# EasyEDA Pro project 2025_11_15_drone.epro

# Schematic Schematic1
Board Name: Board1; Create Date: 2025-11-15; Page Name: P1; Project Name: 2025_11_15_drone; Schematic Name: Schematic1; Update Date: 2025-11-15; Company: EasyEDA.com; Page Size: A4; Version: V1.0
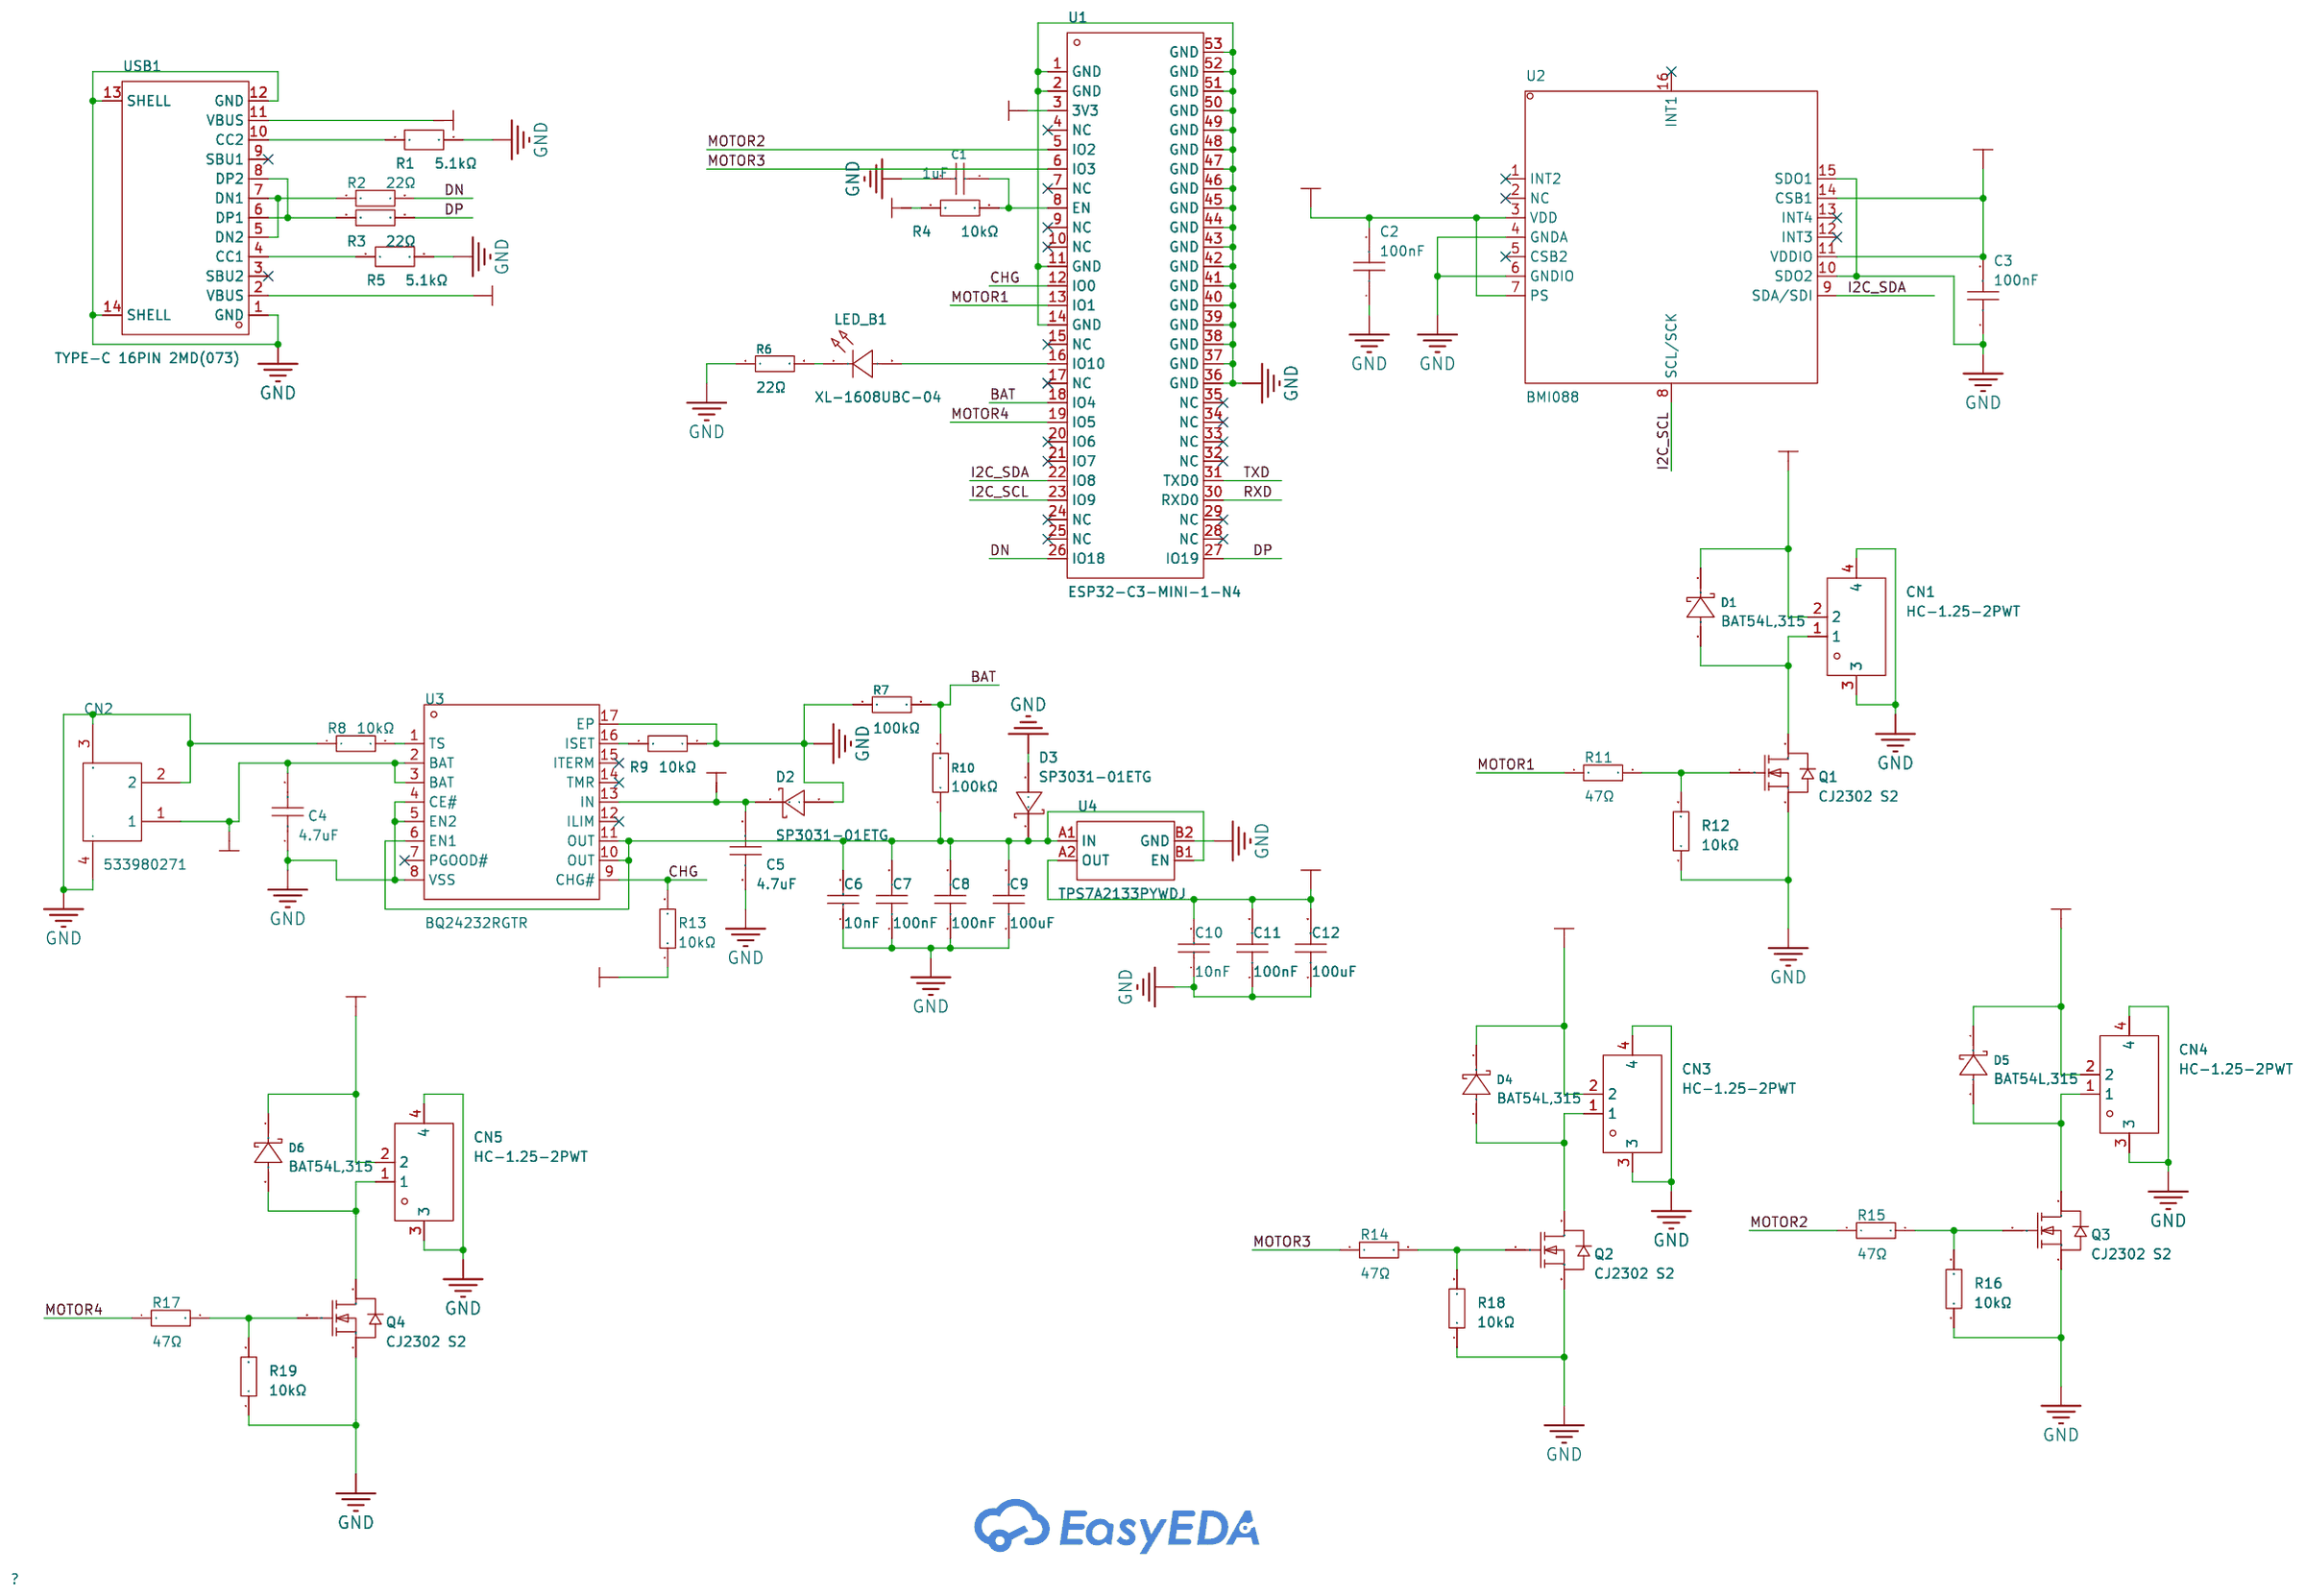
[diagram p0: schematic sheet]

## Parts
C1  1uF  [C0402]
C2  100nF  [C0402]
C3  100nF  [C0402]
C4  4.7uF  [C0402]
C5  4.7uF  [C0402]
C6  10nF  [C0402]
C7  100nF  [C0603]
C8  100nF  [C0603]
C9  100uF  [C1206]
C10  10nF  [C0402]
C11  100nF  [C0603]
C12  100uF  [C1206]
CN1  HC-1.25-2PWT  [CONN-SMD_2P-P1.25-HC-1.25-2PWT]
CN2  533980271  [CONN-SMD_2P-P1.25_053398-0X71]
CN3  HC-1.25-2PWT  [CONN-SMD_2P-P1.25-HC-1.25-2PWT]
CN4  HC-1.25-2PWT  [CONN-SMD_2P-P1.25-HC-1.25-2PWT]
CN5  HC-1.25-2PWT  [CONN-SMD_2P-P1.25-HC-1.25-2PWT]
D1  BAT54L,315  [DFN1006-2L-RD]
D2  SP3031-01ETG  [SOD-882_L1.0-W0.6-RD]
D3  SP3031-01ETG  [SOD-882_L1.0-W0.6-RD]
D4  BAT54L,315  [DFN1006-2L-RD]
D5  BAT54L,315  [DFN1006-2L-RD]
D6  BAT54L,315  [DFN1006-2L-RD]
LED_B1  XL-1608UBC-04  [LED0603-RD_BLUE]
Q1  CJ2302 S2  [SOT-23-3_L3.0-W1.7-P0.95-LS2.9-BR]
Q2  CJ2302 S2  [SOT-23-3_L3.0-W1.7-P0.95-LS2.9-BR]
Q3  CJ2302 S2  [SOT-23-3_L3.0-W1.7-P0.95-LS2.9-BR]
Q4  CJ2302 S2  [SOT-23-3_L3.0-W1.7-P0.95-LS2.9-BR]
R1  5.1kΩ  [R0603]
R2  22Ω  [R0603]
R3  22Ω  [R0603]
R4  10kΩ  [R0603]
R5  5.1kΩ  [R0603]
R6  22Ω  [R0402]
R7  100kΩ  [R0603]
R8  10kΩ  [R0603]
R9  10kΩ  [R0603]
R10  100kΩ  [R0603]
R11  47Ω  [R0402]
R12  10kΩ  [R0402]
R13  10kΩ  [R0603]
R14  47Ω  [R0402]
R15  47Ω  [R0402]
R16  10kΩ  [R0402]
R17  47Ω  [R0402]
R18  10kΩ  [R0402]
R19  10kΩ  [R0402]
U1  ESP32-C3-MINI-1-N4  [WIFIM-SMD_ESP32-C3-MINI-1]
U2  BMI088  [LGA-16_L4.5-W3.0-P0.50-BL]
U3  BQ24232RGTR  [VQFN-16_L3.0-W3.0-P0.50-TL-EP]
U4  TPS7A2133PYWDJ  [DSBGA-4_L0.6-W0.6-P0.35-TL]
USB1  TYPE-C 16PIN 2MD(073)  [USB-C-SMD_TYPE-C-6PIN-2MD-073]

## Library data of the parts
C1 = CL05A105KO5NNNC: Capacitance:1uF Tolerance:±10% Tolerance:±10% Voltage Rating:16V Temperature Coefficient:X5R; LCSC Part Name: 1uF ±10% 16V; Supplier Part: C29266; Manufacturer: SAMSUNG(三星); Supplier Footprint: 0402; JLCPCB Part Class: Extended Part; Datasheet: https://item.szlcsc.com/datasheet/CL05A105KO5NNNC/30018.html; Supplier: LCSC; Tolerance: ±10%; Voltage Rating: 16V; Temperature Coefficient: X5R
C2 C3 = CL05B104KO5NNNC: Capacitance: Tolerance:±10% Tolerance:±10% Voltage Rated: Temperature Coefficient:; LCSC Part Name: 100nF ±10% 16V; Supplier Part: C1525; Manufacturer: SAMSUNG(三星); Supplier Footprint: 0402; JLCPCB Part Class: Basic Part; Datasheet: https://atta.szlcsc.com/upload/public/pdf/source/20160218/1457707763339.pdf; Supplier: LCSC; Tolerance: ±10%
C4 C5 = CL05A475MQ5NRNC_C307423: Capacitance:4.7uF Tolerance:±20% Tolerance:±20% Voltage Rating:6.3V Temperature Coefficient:X5R; LCSC Part Name: 4.7uF ±20% 6.3V; Supplier Part: C307423; Manufacturer: SAMSUNG(三星); Manufacturer Part: CL05A475MQ5NRNC; Supplier Footprint: 0402; JLCPCB Part Class: Extended Part; Datasheet: https://item.szlcsc.com/datasheet/CL05A475MQ5NRNC/291097.html; Supplier: LCSC; Tolerance: ±20%; Voltage Rating: 6.3V; Temperature Coefficient: X5R
C6 C10 = CL05B103KB5NNNC: Capacitance:10nF Tolerance:±10% Tolerance:±10% Voltage Rating:50V Temperature Coefficient:X7R; LCSC Part Name: 10nF ±10% 50V; Supplier Part: C15195; Manufacturer: SAMSUNG(三星); Supplier Footprint: 0402; JLCPCB Part Class: Basic Part; Datasheet: https://item.szlcsc.com/datasheet/CL05B103KB5NNNC/15869.html; Supplier: LCSC; Tolerance: ±10%; Voltage Rating: 50V; Temperature Coefficient: X7R
C7 C8 C11 = CC0603KRX7R9BB104: Capacitance:100nF Tolerance:±10% Tolerance:±10% Voltage Rating:50V Temperature Coefficient:X7R; LCSC Part Name: 100nF ±10% 50V; Supplier Part: C14663; Manufacturer: YAGEO(国巨); Supplier Footprint: 0603; Datasheet: https://item.szlcsc.com/datasheet/CC0603KRX7R9BB104/15331.html; Supplier: LCSC; Tolerance: ±10%; Voltage Rating: 50V; Temperature Coefficient: X7R
C9 C12 = HGC1206R5107M100NSPJ: Capacitance:100uF Tolerance:±20% Tolerance:±20% Voltage Rating:10V Temperature Coefficient:X5R; LCSC Part Name: 100uF ±20% 10V; Supplier Part: C7432784; Manufacturer: Chinocera(华瓷); Supplier Footprint: 1206; JLCPCB Part Class: Extended Part; Datasheet: https://atta.szlcsc.com/upload/public/pdf/source/20240320/FAC3FEC40A78BC5CCCE96C232A94D860.pdf; Supplier: LCSC; Tolerance: ±20%; Voltage Rating: 10V; Temperature Coefficient: X5R
CN1 CN3-CN5 = HC-1.25-2PWT: Pins Structure:1x2P Pitch:1.25mm Mounting Style:Horizontal attachment Reference Series:PicoBlade(MX 1.25) Number of Pins:2P Number of Rows:1 Number of PINs Per Row:2 Row Spacing:- Current Rating (Max):1A Contact Material:Brass Contact Plating:Tin Operatin; LCSC Part Name: 1x2P 间距:1.25mm 卧贴 系列:PicoBlade(MX 1.25); Supplier Part: C2845379; Manufacturer: HCTL(华灿天禄); Supplier Footprint: SMD,P=1.25mm,卧贴; JLCPCB Part Class: Extended Part; Datasheet: https://atta.szlcsc.com/upload/public/pdf/source/20240930/9508A8292CCC87B0C29E3A028D56E30A.pdf; Supplier: LCSC; Pins Structure: 1x2P; Pitch: 1.25mm; Mounting Style: Horizontal attachment; Reference Series: PicoBlade(MX 1.25); Number of Pins: 2P; Number of Rows: 1; Number of PINs Per Row: 2; Current Rating (Max): 1A; Contact Material: Brass; Contact Plating: Tin; Operating Temperature Range: -40℃~+105℃; Rated Voltage (Max): 125V; Plastic Material: LCP; Flame Retardant Rating: UL94V-0; Supplementary Features: Auxiliary soldering legs; Z-Height of the Board: 3.57mm; X-Length of Bottom Edge on Board (Spacing Line): 7.55mm; Y-Width of Bottom Edge on Board: 5.25mm
CN2 = 533980271_C122410: Pins Structure:1x2P Pitch:1.25mm Mounting Type:Surface Mount,Vertical Reference Series:PicoBlade(MX 1.25) Number of Pins:2P Number of Rows:1 Number of PINs Per Row:2 Row Spacing:- Current Rating:1A Contact Material:Phosphor Bronze Contact Plating:Tin Oper; LCSC Part Name: 1x2P 间距:1.25mm 立贴 系列:PicoBlade(MX 1.25); Supplier Part: C122410; Manufacturer: MOLEX; Supplier Footprint: SMD,P=1.25mm; JLCPCB Part Class: Extended Part; Datasheet: https://www.molex.com/content/dam/molex/molex-dot-com/products/automated/en-us/salesdrawingpdf/533/53398/533980271_sd.pdf?inline; Supplier: LCSC; Pins Structure: 1x2P; Pitch: 1.25mm; Mounting Type: Surface Mount,Vertical; Reference Series: PicoBlade(MX 1.25); Number of Pins: 2P; Number of Rows: 1; Number of PINs Per Row: 2; Current Rating: 1A; Contact Material: Phosphor Bronze; Contact Plating: Tin; Operating Temperature: -40℃~+105℃; Voltage Rating: 125V; Plastic Material: Glass-Fiber Reinforced PA; Flame Retardant Rating: UL94V-0; Supplementary Features: Auxiliary Solder Pin; Color: White; Z-Height of the Board: 4.7mm; X-Length of Bottom Edge on Board (Spacing Line): 7.65mm; Y-Width of Bottom Edge on Board: 4.2mm
D1 D4-D6 = BAT54L,315: Voltage - Forward(Vf@If):800mV@100mA Voltage - DC Reverse(Vr):30V Current - Rectified:200mA Reverse Leakage Current (Ir):2uA@25V Non-Repetitive Peak Forward Surge Current:600mA; LCSC Part Name: 电压:30V 电流:200mA; Supplier Part: C549279; Manufacturer: Nexperia(安世); Supplier Footprint: DFN1006-2; JLCPCB Part Class: Extended Part; Datasheet: https://item.szlcsc.com/datasheet/BAT54L%252C315/570347.html; Supplier: LCSC; Voltage - Forward(Vf@If): 800mV@100mA; Voltage - DC Reverse(Vr): 30V; Current - Rectified: 200mA; Reverse Leakage Current (Ir): 2uA@25V; Non-Repetitive Peak Forward Surge Current: 600mA
D2 D3 = SP3031-01ETG: Polarity:Unidirectional Reverse Stand-Off Voltage (Vrwm):5V Clamping Voltage:7.5V Peak Pulse Current (Ipp):5A@8/20us Peak Pulse Power Dissipation (Ppp):- Voltage - Breakdown:6V Reverse Leakage Current (Ir):1uA Number of Channels:1.0 level of protection:IE; Supplier Part: C207283; Manufacturer: Littelfuse(美国力特); Supplier Footprint: SOD-882; JLCPCB Part Class: Extended Part; Datasheet: https://item.szlcsc.com/datasheet/SP3031-01ETG/208402.html; Supplier: LCSC; Polarity: Unidirectional; Reverse Stand-Off Voltage (Vrwm): 5V; Clamping Voltage: 7.5V; Peak Pulse Current (Ipp): 5A@8/20us; Voltage - Breakdown: 6V; Reverse Leakage Current (Ir): 1uA; Number of Channels: 1.0; level of protection: IEC 61000-4-4；IEC 61000-4-5；IEC 61000-4-2; Type: TVS; Junction Capacitance: 0.8pF
LED_B1 = XL-1608UBC-04: Lamp Holder Type:- Illumination Color:Blue Voltage - Forward(Vf):3.3V Voltage - Forward(Vf):3.3V Power(Watts):70mW Forward Current:20mA Wavelength - Dominant:455nm~475nm Wavelength - Dominant:455nm~475nm Peak Wavelength:470nm Diode Configuration:- Lens Co; Supplier Part: C965807; Manufacturer: XINGLIGHT(成兴光); Supplier Footprint: 0603; JLCPCB Part Class: Extended Part; Datasheet: https://item.szlcsc.com/datasheet/XL-1608UBC-04/1051416.html; Supplier: LCSC; Illumination Color: Blue; Voltage - Forward(Vf): 3.3V; Power(Watts): 70mW; Forward Current: 20mA; Wavelength - Dominant: 455nm~475nm; Peak Wavelength: 470nm; Lens Color: Water Clear; Luminous Intensity: 300mcd; Viewing Angle: 120°; Mounting Style: op View Mount
Q1-Q4 = CJ2302 S2: Type:1 N-Channel Drain Source Voltage (Vdss): Continuous Drain Current (Id): Drain Source On Resistance (RDS(on)@Vgs,Id):0.115Ω@2.5V,3.1A Power Dissipation (Pd):350mW Gate Threshold Voltage (Vgs(th)@Id):1.2V@50uA Total Gate Charge (Qg@Vgs):10nC@4.5V Input; LCSC Part Name: 1个N沟道 耐压:20V 电流:2.1A; Supplier Part: C8548; Manufacturer: CJ(江苏长电/长晶); Supplier Footprint: SOT-23; JLCPCB Part Class: Extended Part; Datasheet: https://atta.szlcsc.com/upload/public/pdf/source/20130613/1457706609595.pdf; Supplier: LCSC; Type: 1 N-Channel; Drain Source On Resistance (RDS(on)@Vgs,Id): 0.115Ω@2.5V,3.1A; Power Dissipation (Pd): 350mW; Gate Threshold Voltage (Vgs(th)@Id): 1.2V@50uA; Total Gate Charge (Qg@Vgs): 10nC@4.5V; Input Capacitance (Ciss@Vds): 300pF@10V; Reverse Transfer Capacitance (Crss@Vds): 80pF@10V; Operating Temperature: -55℃~+150℃
R1 R5 = FRC0603F5101TS: Type:Thick Film Resistor Resistance:5.1kΩ Tolerance:±1% Tolerance:±1% Power(Watts):100mW Voltage-Supply(Max):75V Temperature Coefficient:±100ppm/℃ Temperature Coefficient:±100ppm/℃ Operating Temperature:-55℃~+155℃ Operating Temperature:-55℃~+155℃; LCSC Part Name: 5.1kΩ ±1% 100mW 厚膜电阻; Supplier Part: C2907044; Manufacturer: FOJAN(富捷); Supplier Footprint: 0603; JLCPCB Part Class: Extended Part; Supplier: LCSC; Type: Thick Film Resistor; Tolerance: ±1%; Power(Watts): 100mW; Voltage-Supply(Max): 75V; Temperature Coefficient: ±100ppm/℃; Operating Temperature: -55℃~+155℃
R2 R3 = 0603WAF220JT5E: Type:Thick Film Resistors Resistance:22Ω Tolerance:±1% Tolerance:±1% Power(Watts): Overload Voltage (Max): Temperature Coefficient:±100ppm/℃ Temperature Coefficient:±100ppm/℃ Operating Temperature Range:-55℃~+155℃ Operating Temperature Range:-55℃~+155℃; LCSC Part Name: 22Ω ±1% 100mW 厚膜电阻; Supplier Part: C23345; Manufacturer: UNI-ROYAL(厚声); Supplier Footprint: 0603; JLCPCB Part Class: Basic Part; Datasheet: https://atta.szlcsc.com/upload/public/pdf/source/20200306/C422600_1E6D84923E4A46A82E41ADD87F860B5C.pdf; Supplier: LCSC; Type: Thick Film Resistors; Tolerance: ±1%; Temperature Coefficient: ±100ppm/℃; Operating Temperature Range: -55℃~+155℃
R4 R8 R9 R13 = RC0603FR-0710KL: Type:Thick Film Resistors Resistance: Tolerance:±1% Tolerance:±1% Power(Watts): Overload Voltage (Max): Temperature Coefficient:±100ppm/℃ Temperature Coefficient:±100ppm/℃ Operating Temperature Range:-55℃~+155℃ Operating Temperature Range:-55℃~+155℃; LCSC Part Name: 厚膜电阻 10kΩ ±1% 100mW; Supplier Part: C98220; Manufacturer: YAGEO(国巨); Supplier Footprint: 0603; JLCPCB Part Class: Extended Part; Datasheet: https://atta.szlcsc.com/upload/public/pdf/source/20180927/C295883_E8D83085EA81BD7DE0B2B681138C15EE.pdf; Supplier: LCSC; Type: Thick Film Resistors; Tolerance: ±1%; Temperature Coefficient: ±100ppm/℃; Operating Temperature Range: -55℃~+155℃
R6 = 0402WGF220JTCE: Type:Thick Film Resistors Resistance:22Ω Tolerance:±1% Tolerance:±1% Power(Watts): Overload Voltage (Max): Temperature Coefficient:±100ppm/℃ Temperature Coefficient:±100ppm/℃ Operating Temperature Range:-55℃~+155℃ Operating Temperature Range:-55℃~+155℃; LCSC Part Name: 22Ω ±1% 62.5mW 厚膜电阻; Supplier Part: C25092; Manufacturer: UNI-ROYAL(厚声); Supplier Footprint: 0402; JLCPCB Part Class: Basic Part; Datasheet: https://atta.szlcsc.com/upload/public/pdf/source/20200306/C422600_1E6D84923E4A46A82E41ADD87F860B5C.pdf; Supplier: LCSC; Type: Thick Film Resistors; Tolerance: ±1%; Temperature Coefficient: ±100ppm/℃; Operating Temperature Range: -55℃~+155℃
R7 R10 = RC0603FR-07100KL: Type:Thick Film Resistors Resistance: Tolerance:±1% Tolerance:±1% Power(Watts): Overload Voltage (Max): Temperature Coefficient:±100ppm/℃ Temperature Coefficient:±100ppm/℃ Operating Temperature Range:-55℃~+155℃ Operating Temperature Range:-55℃~+155℃; LCSC Part Name: 厚膜电阻 100kΩ ±1% 100mW; Supplier Part: C14675; Manufacturer: YAGEO(国巨); Supplier Footprint: 0603; JLCPCB Part Class: Extended Part; Datasheet: https://atta.szlcsc.com/upload/public/pdf/source/20140324/1457707028752.pdf; Supplier: LCSC; Type: Thick Film Resistors; Tolerance: ±1%; Temperature Coefficient: ±100ppm/℃; Operating Temperature Range: -55℃~+155℃
R11 R14 R15 R17 = RC0402FR-0747RL: Type:Thick Film Resistor Resistance:47Ω Tolerance:±1% Tolerance:±1% Power(Watts):62.5mW Voltage-Supply(Max):50V Temperature Coefficient:±100ppm/℃ Temperature Coefficient:±100ppm/℃ Operating Temperature:-55℃~+155℃ Operating Temperature:-55℃~+155℃; LCSC Part Name: 厚膜电阻 47Ω ±1% 62.5mW; Supplier Part: C137973; Manufacturer: YAGEO(国巨); Supplier Footprint: 0402; Datasheet: https://item.szlcsc.com/datasheet/RC0402FR-0747RL/149289.html; Supplier: LCSC; Type: Thick Film Resistor; Tolerance: ±1%; Power(Watts): 62.5mW; Voltage-Supply(Max): 50V; Temperature Coefficient: ±100ppm/℃; Operating Temperature: -55℃~+155℃
R12 R16 R18 R19 = RC0402FR-0710KL: Type:Thick Film Resistor Resistance:10kΩ Tolerance:±1% Tolerance:±1% Power(Watts):62.5mW Voltage-Supply(Max):50V Temperature Coefficient:±100ppm/℃ Temperature Coefficient:±100ppm/℃ Operating Temperature:-55℃~+155℃ Operating Temperature:-55℃~+155℃; LCSC Part Name: 厚膜电阻 10kΩ ±1% 62.5mW; Supplier Part: C60490; Manufacturer: YAGEO(国巨); Supplier Footprint: 0402; Datasheet: https://item.szlcsc.com/datasheet/RC0402FR-0710KL/61542.html; Supplier: LCSC; Type: Thick Film Resistor; Tolerance: ±1%; Power(Watts): 62.5mW; Voltage-Supply(Max): 50V; Temperature Coefficient: ±100ppm/℃; Operating Temperature: -55℃~+155℃
U1 = ESP32-C3-MINI-1-N4: Supplier Part: C2838502; Manufacturer: ESPRESSIF(乐鑫); Supplier Footprint: SMD,13.2x16.6mm; JLCPCB Part Class: Extended Part; Datasheet: https://item.szlcsc.com/datasheet/ESP32-C3-MINI-1-N4/3013227.html; Supplier: LCSC
U2 = BMI088: Sensor Type:加速度计陀螺仪 Operating Temperature:-40℃~+85℃ Operating Temperature:-40℃~+85℃; Supplier Part: C194919; Manufacturer: Bosch(博世); Supplier Footprint: LGA-16(3x4.5); JLCPCB Part Class: Extended Part; Datasheet: https://atta.szlcsc.com/upload/public/pdf/source/20180628/C194919_66CCF125FF968C218A4D358C68AC68D6.pdf; Supplier: LCSC; Sensor Type: 加速度计陀螺仪; Operating Temperature: -40℃~+85℃
U3 = BQ24232RGTR: LCSC Part Name: USB友好型锂离子电池充电器及电源路径管理IC; Supplier Part: C528622; Manufacturer: TI(德州仪器); Supplier Footprint: VQFN-16-EP(3x3); JLCPCB Part Class: Extended Part; Datasheet: https://www.ti.com/cn/lit/gpn/bq24232; Supplier: LCSC
U4 = TPS7A2133PYWDJ: Output Type:Fixed Maximum Input Voltage:6V Output Voltage:3.3V Output Voltage:3.3V Output Current:500mA Power Supply Rejection Ratio (PSRR):61dB@(100Hz) Operating Temperature:-40℃~+125℃@(Tj) Operating Temperature:-40℃~+125℃@(Tj) Output Polarity:Positive e; LCSC Part Name: 500mA 低噪声、低 IQ、高 PSRR 低压降 (LDO) 稳压器; Supplier Part: C3019997; Manufacturer: TI(德州仪器); Supplier Footprint: DSBGA-4; JLCPCB Part Class: Extended Part; Datasheet: https://www.ti.com/cn/lit/gpn/tps7a21; Supplier: LCSC; Output Type: Fixed; Maximum Input Voltage: 6V; Output Voltage: 3.3V; Output Current: 500mA; Power Supply Rejection Ratio (PSRR): 61dB@(100Hz); Operating Temperature: -40℃~+125℃@(Tj); Output Polarity: Positive electrode; Number of Outputs: 1
USB1 = TYPE-C 16PIN 2MD(073): Connector Type:Type-C Protocol Standard:- Gender:Female Mounting Type:Surface Mount, Right Angle Number of Contacts:16P Number of Ports:1 Current Rating-Power:3A Voltage Rating:5V Connect-Disconnect Life:5,000 Cycles Supplementary Features:- Center Height; LCSC Part Name: Type-C 母 卧贴; Supplier Part: C2765186; Manufacturer: SHOU HAN(首韩); Supplier Footprint: SMD; JLCPCB Part Class: Extended Part; Datasheet: https://item.szlcsc.com/datasheet/TYPE-C%252016PIN%25202MD(073)/2901843.html; Supplier: LCSC; Connector Type: Type-C; Gender: Female; Mounting Type: Surface Mount, Right Angle; Number of Contacts: 16P; Number of Ports: 1; Current Rating-Power: 3A; Voltage Rating: 5V; Connect-Disconnect Life: 5,000 Cycles; Detection color: Black; Operating Temperature: -25℃~+85℃

## Nets
3V3: C2.2 C3.2 C10.2 C11.2 C12.2 CN1.2 CN3.2 CN4.2 CN5.2 D1.1(K) D4.1(K) D5.1(K) D6.1(K) R4.2 R13.1 U1.3(3V3) U2.3(VDD) U2.7(PS) U2.11(VDDIO) U2.14(CSB1) U4.A2(OUT)
GND: C1.2 C2.1 C3.1 C4.1 C5.1 C6.1 C7.1 C8.1 C9.1 C10.1 C11.1 C12.1 CN1.3 CN1.4 CN2.2 CN2.3 CN2.4 CN3.3 CN3.4 CN4.3 CN4.4 CN5.3 CN5.4 D2.2(A) D3.2(A) Q1.2(S) Q2.2(S) Q3.2(S) Q4.2(S) R1.2 R5.2 R6.1 R7.2 R8.1 R9.1 R12.1 R16.1 R18.1 R19.1 U1.1(GND) U1.2(GND) U1.11(GND) U1.14(GND) U1.36(GND) U1.37(GND) U1.38(GND) U1.39(GND) U1.40(GND) U1.41(GND) U1.42(GND) U1.43(GND) U1.44(GND) U1.45(GND) U1.46(GND) U1.47(GND) U1.48(GND) U1.49(GND) U1.50(GND) U1.51(GND) U1.52(GND) U1.53(GND) U2.4(GNDA) U2.6(GNDIO) U2.10(SDO2) U2.15(SDO1) U3.4(CE#) U3.5(EN2) U3.8(VSS) U3.17(EP) U4.B2(GND) USB1.1(GND) USB1.12(GND) USB1.13(SHELL) USB1.14(SHELL)
VBAT: C4.2 CN2.1 U3.2(BAT) U3.3(BAT)
BAT: R7.1 R10.2 U1.18(IO4)
CHG: R13.2 U1.12(IO0) U3.9(CHG#)
DN: R2.2 U1.26(IO18)
DP: R3.2 U1.27(IO19)
I2C_SCL: U1.23(IO9) U2.8(SCL/SCK)
I2C_SDA: U1.22(IO8) U2.9(SDA/SDI)
MOTOR1: R11.1 U1.13(IO1)
MOTOR2: R15.1 U1.5(IO2)
MOTOR3: R14.1 U1.6(IO3)
MOTOR4: R17.1 U1.19(IO5)
RXD: U1.30(RXD0)
TXD: U1.31(TXD0)
VUSB: C5.2 D2.1(K) U3.13(IN) USB1.2(VBUS) USB1.11(VBUS)
$1N1713: C6.2 C7.2 C8.2 C9.2 D3.1(K) R10.1 U3.6(EN1) U3.10(OUT) U3.11(OUT) U4.A1(IN) U4.B1(EN)
$1N1725: C1.1 R4.1 U1.8(EN)
$1N1752: R9.2 U3.16(ISET)
$1N1757: R8.2 U3.1(TS)
$1N2261: CN1.1 D1.2(A) Q1.3(D)
$1N2262: Q1.1(G) R11.2 R12.2
$1N3276: CN4.1 D5.2(A) Q3.3(D)
$1N3282: Q3.1(G) R15.2 R16.2
$1N3530: CN3.1 D4.2(A) Q2.3(D)
$1N3536: Q2.1(G) R14.2 R18.2
$1N3784: CN5.1 D6.2(A) Q4.3(D)
$1N3790: Q4.1(G) R17.2 R19.2
$1N3965: LED_B1.1(K) R6.2
$1N3966: LED_B1.2(A) U1.16(IO10)
$1N4623: R5.1 USB1.4(CC1)
$1N4675: R1.1 USB1.10(CC2)
$1N4714: R2.1 USB1.5(DN2) USB1.7(DN1)
$1N4755: R3.1 USB1.6(DP1) USB1.8(DP2)

Not connected (* = marked no-connect by the designer): U1 4(NC)* 7(NC)* 9(NC)* 10(NC)* 15(NC)* 17(NC)* 20(IO6)* 21(IO7)* 24(NC)* 25(NC)* 28(NC)* 29(NC)* 32(NC)* 33(NC)* 34(NC)* 35(NC)*; U2 1(INT2)* 2(NC)* 5(CSB2)* 12(INT3)* 13(INT4)* 16(INT1)*; U3 7(PGOOD#)* 12(ILIM)* 14(TMR)* 15(ITERM)*; USB1 3(SBU2)* 9(SBU1)*

# Board PCB1
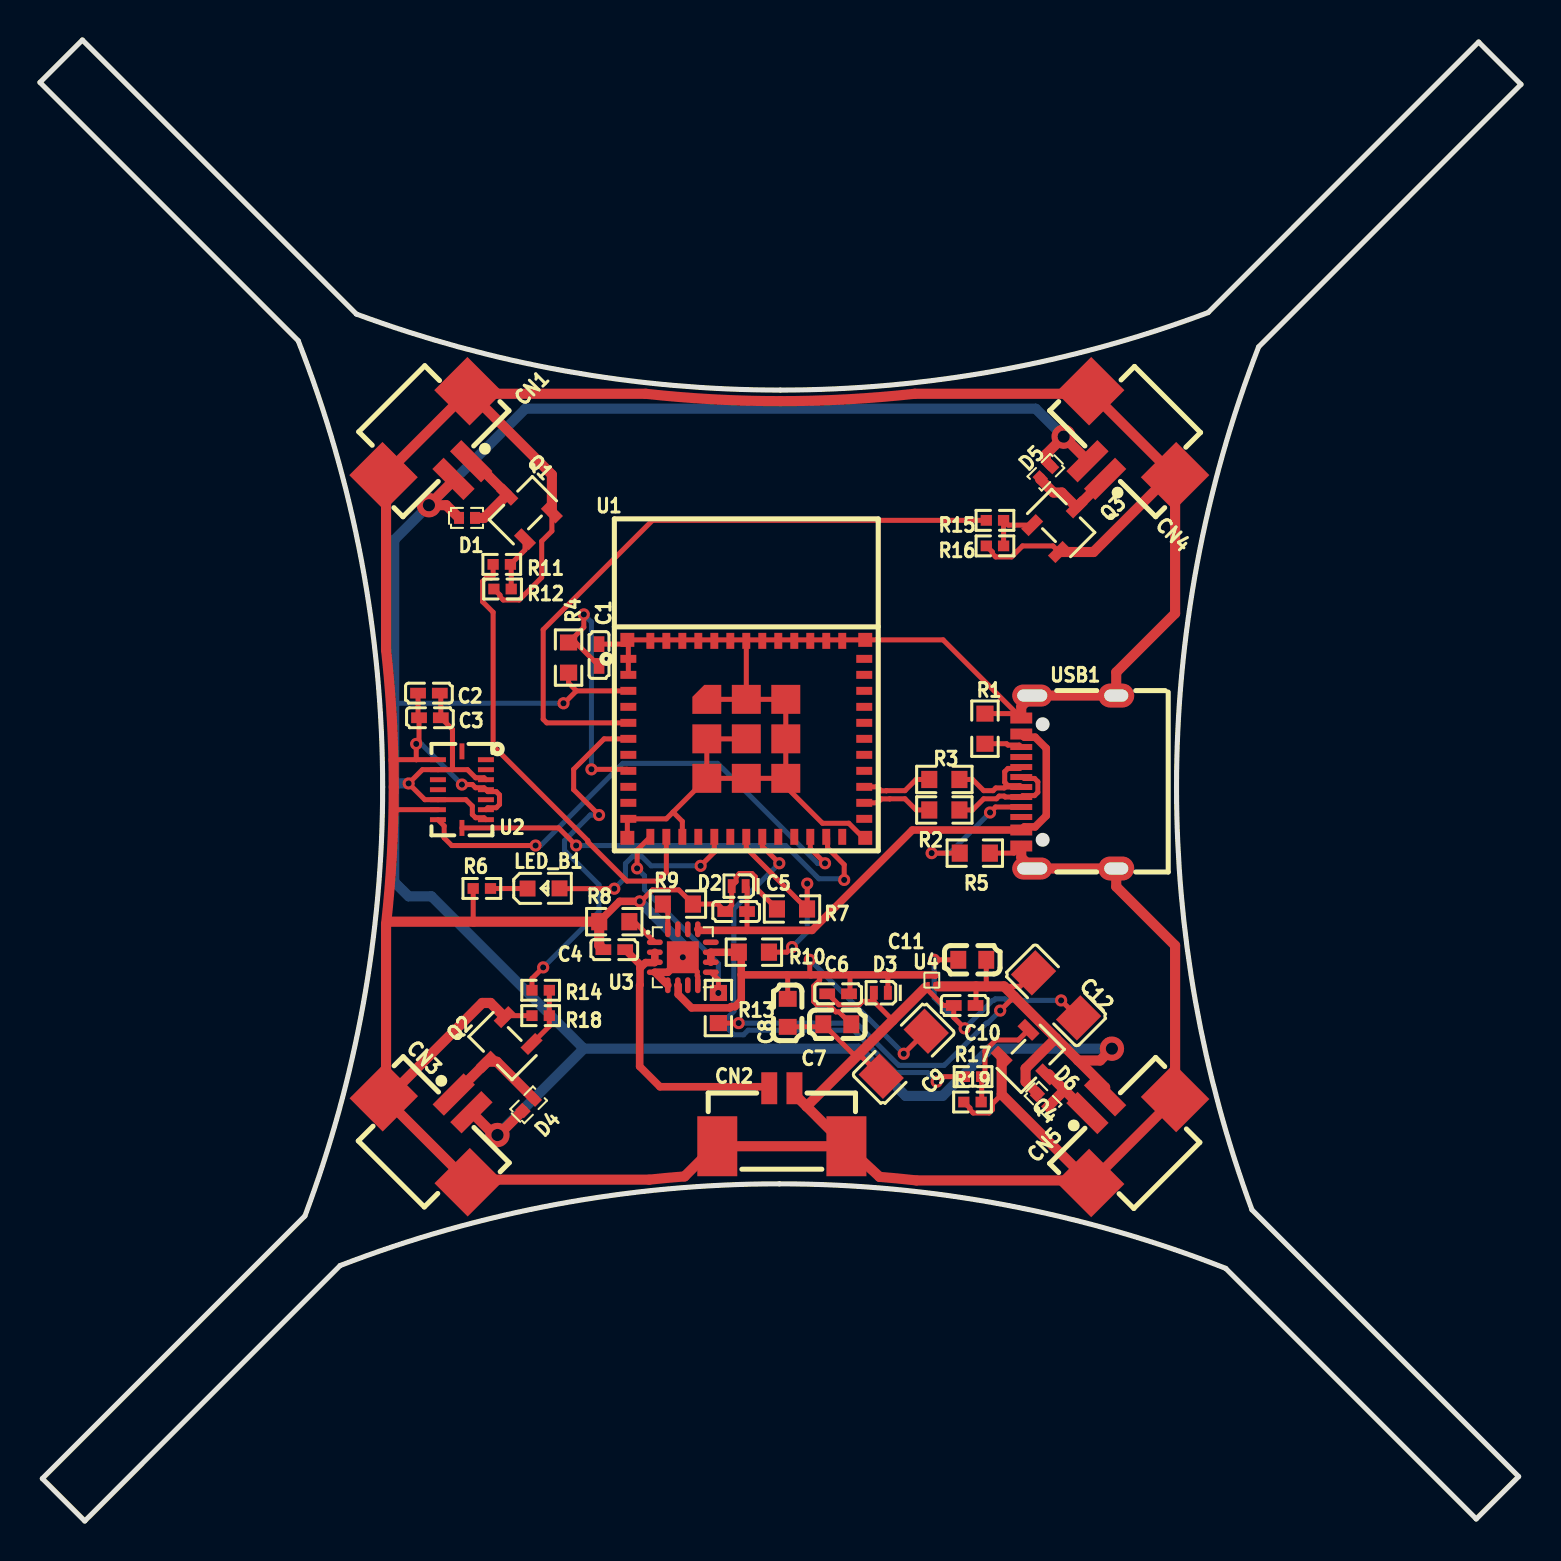
[diagram p1: board, top side]
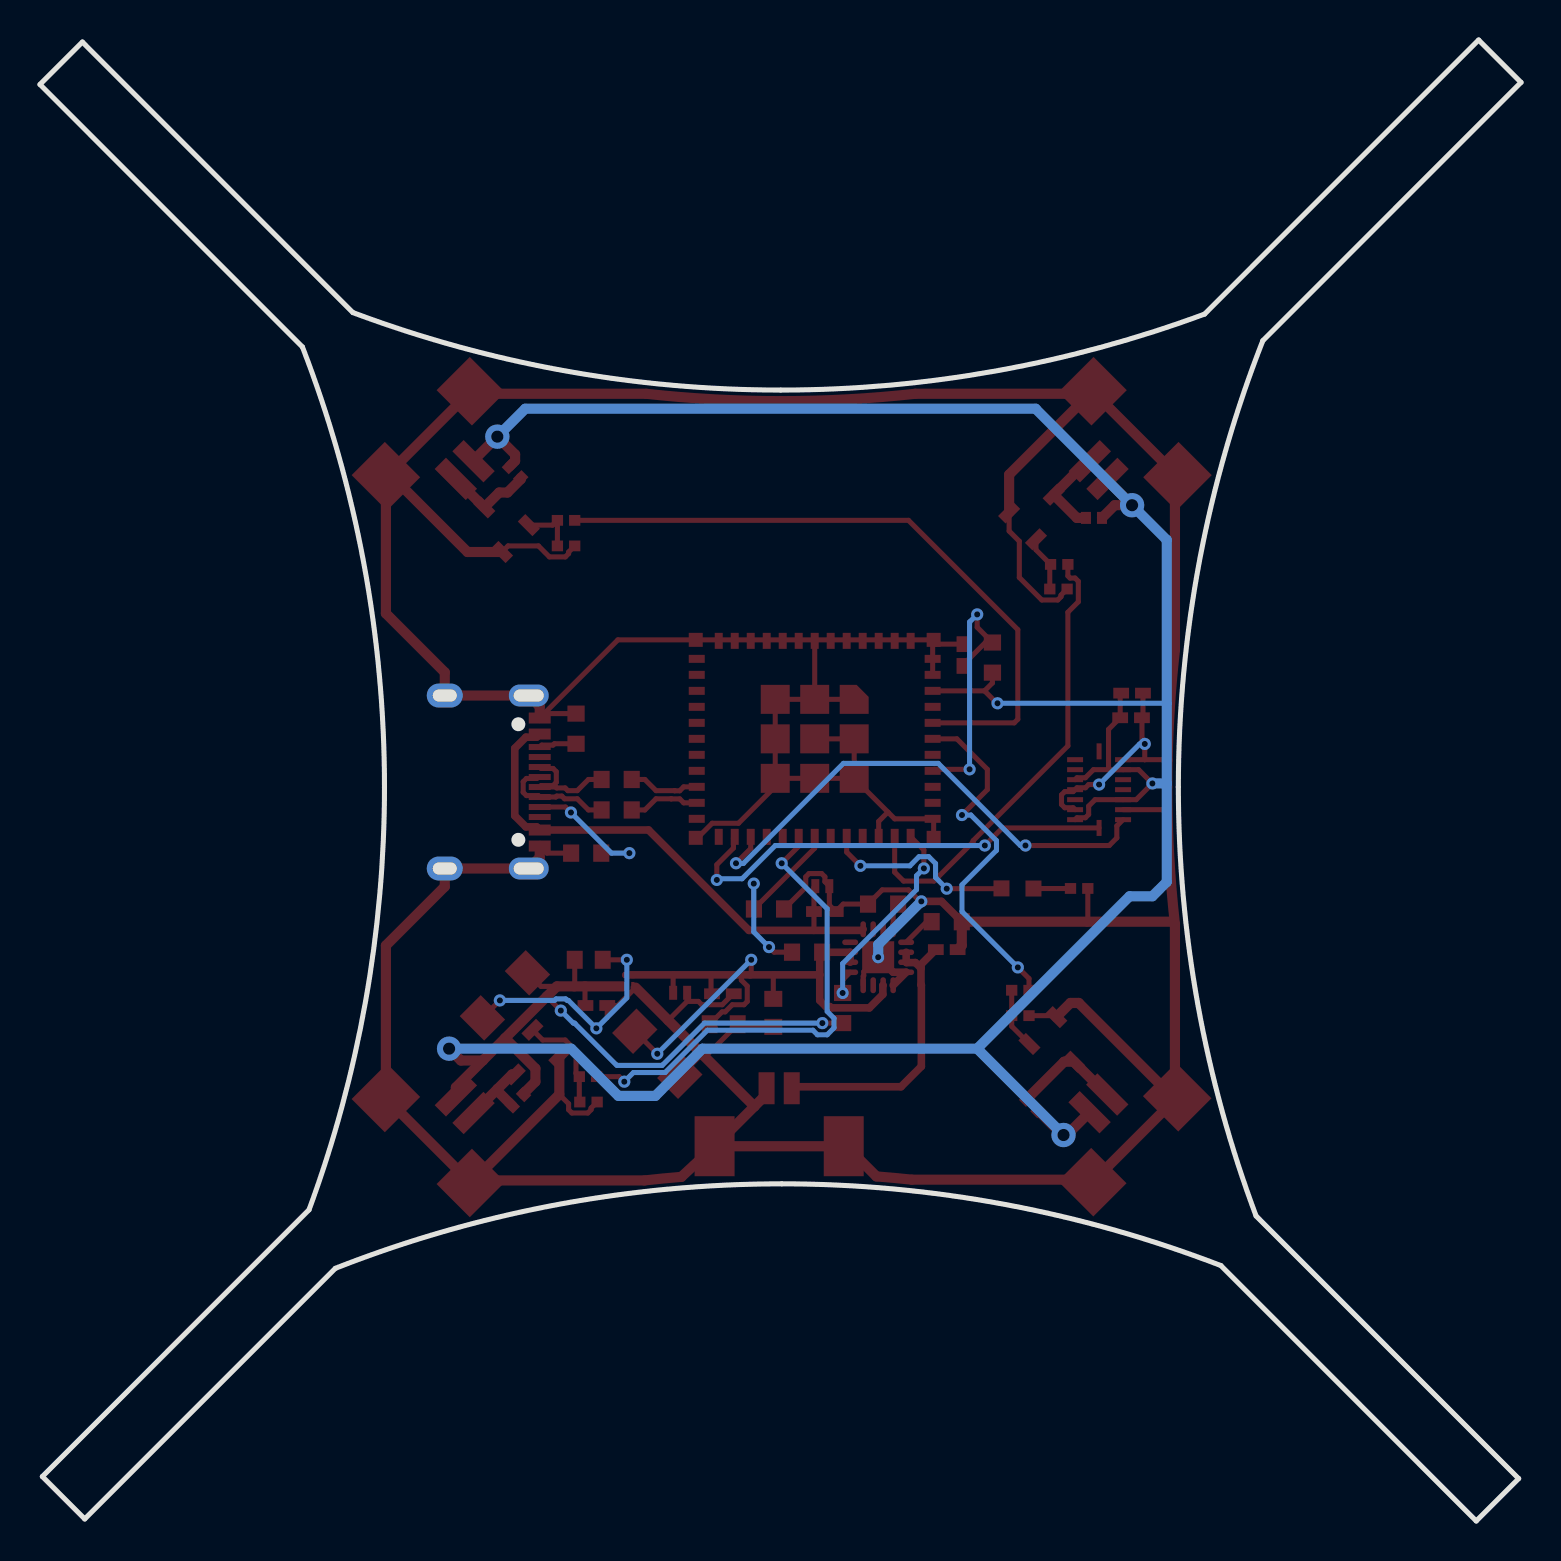
[diagram p2: board, bottom side, seen from below]

Outline 74.08 x 74.06 mm; copper layers: Top Layer, Bottom Layer. Coordinates in mm from the lower left corner of the outline.
Outline path: 0,71.94 2.12,74.06 15.83,60.36 arc(26.26,57.52) 37.03,56.56 arc(47.9,57.53) 58.43,60.43 71.96,73.96 74.08,71.84 60.95,58.71 arc(57.89,47.9) 56.85,36.7 arc(57.8,25.96) 60.63,15.56 73.96,2.22 71.84,0.1 59.31,12.64 arc(48.34,15.8) 36.98,16.86 arc(25.81,15.83) 15.02,12.78 2.24,0 0.12,2.12 13.25,15.26 arc(16.16,25.8) 17.14,36.7 arc(16.08,48.06) 12.91,59.03 0,71.94
Stack: Top Layer 0.035mm / Dielectric1 1.51mm FR4 er 4.5 / Bottom Layer 0.035mm

## Design rules (mm)
net DN: DP2
net DP: DP2
net $1N4714: DP3
net $1N4755: DP3
template: JLCPCB Capability(Two Layers Board)
spacing copperThickness1oz (default): track to track 0.102, other pairs 0.152 to 0.3
spacing copperThickness2oz: track to track 0.203, other pairs 0.152 to 0.3
track width copperThickness1oz (default): min 0.127, default 0.254, max 2.54
track width copperThickness2oz: min 0.203, default 0.254, max 2.54
differential pair differentialPair (default): width min 0.127, default 0.254, max 2.54; gap min 0.152, default 0.152
via viaSize (default): diameter min 0.5, default 0.61, max 10; hole min 0.3, default 0.305, max 6.3

## Placement (name value [footprint] x y rotation side)
C1  1uF  [C0402]  27.96 43.31 90 top
C2  100nF  [C0402]  19.46 41.4 0 top
C3  100nF  [C0402]  19.51 40.17 0 top
C4  4.7uF  [C0402]  28.73 28.57 0 top
C5  4.7uF  [C0402]  34.82 30.48 0 top
C6  10nF  [C0402]  39.92 26.37 0 top
C7  100nF  [C0603]  39.88 24.84 0 top
C8  100nF  [C0603]  37.4 25.41 90 top
C9  100uF  [C1206]  43.2 23.37 45 top
C10  10nF  [C0402]  46.25 25.78 0 top
C11  100nF  [C0603]  46.63 28.07 0 top
C12  100uF  [C1206]  50.82 26.29 135 top
CN1  HC-1.25-2PWT  [CONN-SMD_2P-P1.25-HC-1.25-2PWT]  20.22 53.47 225 top
CN2  533980271  [CONN-SMD_2P-P1.25_053398-0X71]  37.11 20.19 0 top
CN3  HC-1.25-2PWT  [CONN-SMD_2P-P1.25-HC-1.25-2PWT]  20.23 19.98 315 top
CN4  HC-1.25-2PWT  [CONN-SMD_2P-P1.25-HC-1.25-2PWT]  53.75 53.47 135 top
CN5  HC-1.25-2PWT  [CONN-SMD_2P-P1.25-HC-1.25-2PWT]  53.75 19.94 45 top
D1  BAT54L,315  [DFN1006-2L-RD]  21.36 50.16 0 top
D2  SP3031-01ETG  [SOD-882_L1.0-W0.6-RD]  34.95 31.75 180 top
D3  SP3031-01ETG  [SOD-882_L1.0-W0.6-RD]  42.06 26.42 180 top
D4  BAT54L,315  [DFN1006-2L-RD]  24.44 20.81 45 top
D5  BAT54L,315  [DFN1006-2L-RD]  50.32 52.45 225 top
D6  BAT54L,315  [DFN1006-2L-RD]  50.17 21.05 315 top
LED_B1  XL-1608UBC-04  [LED0603-RD_BLUE]  25.19 31.63 0 top
Q1  CJ2302 S2  [SOT-23-3_L3.0-W1.7-P0.95-LS2.9-BR]  24.15 50.55 315 top
Q2  CJ2302 S2  [SOT-23-3_L3.0-W1.7-P0.95-LS2.9-BR]  23.14 23.75 45 top
Q3  CJ2302 S2  [SOT-23-3_L3.0-W1.7-P0.95-LS2.9-BR]  51.08 49.91 225 top
Q4  CJ2302 S2  [SOT-23-3_L3.0-W1.7-P0.95-LS2.9-BR]  49.55 23.11 135 top
R1  5.1kΩ  [R0603]  47.27 39.62 90 top
R2  22Ω  [R0603]  45.24 35.56 180 top
R3  22Ω  [R0603]  45.24 37.08 180 top
R4  10kΩ  [R0603]  26.44 43.18 270 top
R5  5.1kΩ  [R0603]  46.76 33.4 0 top
R6  22Ω  [R0402]  22.1 31.63 0 top
R7  100kΩ  [R0603]  37.62 30.61 180 top
R8  10kΩ  [R0603]  28.73 29.97 0 top
R9  10kΩ  [R0603]  31.91 30.85 180 top
R10  100kΩ  [R0603]  35.71 28.45 0 top
R11  47Ω  [R0402]  23.1 47.84 0 top
R12  10kΩ  [R0402]  23.14 46.61 0 top
R13  10kΩ  [R0603]  33.93 25.65 90 top
R14  47Ω  [R0402]  25.04 26.54 0 top
R15  47Ω  [R0402]  47.77 50.04 0 top
R16  10kΩ  [R0402]  47.77 48.76 0 top
R17  47Ω  [R0402]  46.67 22.22 0 top
R18  10kΩ  [R0402]  25.04 25.27 0 top
R19  10kΩ  [R0402]  46.65 20.95 0 top
U1  ESP32-C3-MINI-1-N4  [WIFIM-SMD_ESP32-C3-MINI-1]  35.33 39.12 0 top
U2  BMI088  [LGA-16_L4.5-W3.0-P0.50-BL]  21.11 36.58 180 top
U3  BQ24232RGTR  [VQFN-16_L3.0-W3.0-P0.50-TL-EP]  32.16 28.19 0 top
U4  TPS7A2133PYWDJ  [DSBGA-4_L0.6-W0.6-P0.35-TL]  44.6 27.05 270 top
USB1  TYPE-C 16PIN 2MD(073)  [USB-C-SMD_TYPE-C-6PIN-2MD-073]  51.46 36.96 90 top

## Footprints (pads in the part's own frame, mm; a bottom-side part is the same pattern mirrored in y, then rotated)
C0402
  rect 0.79x0.54 smd: 1(-0.545,0) 2(0.545,0)
C0603
  rect 0.8x0.9 smd: 1(-0.7,0) 2(0.7,0)
C1206
  rect 1.485x1.728 smd: 1(-1.593,0) 2(1.593,0)
CONN-SMD_2P-P1.25-HC-1.25-2PWT
  rect 0.8x2.2 smd: 1(-0.625,1.285) 2(0.625,1.285)
  rect 2.35x2.5 smd: 3(-3.005,-1.285) 4(3.005,-1.285)
CONN-SMD_2P-P1.25_053398-0X71
  rect 0.8x1.6 smd: 1(-0.63,1.45) 2(0.63,1.45)
  rect 2x3 smd: 3(3.229,-1.45) 4(-3.229,-1.45)
DFN1006-2L-RD
  rect 0.5x0.6 smd: 1(-0.4,0) 2(0.4,0)
DSBGA-4_L0.6-W0.6-P0.35-TL
  rect 0.165x0.165 smd: A1(-0.175,0.175) A2(0.175,0.175) B1(-0.175,-0.175) B2(0.175,-0.175)
LED0603-RD_BLUE
  rect 0.8x0.8 smd: 1(-0.799,-0.004) 2(0.799,0.004)
LGA-16_L4.5-W3.0-P0.50-BL
  rect 0.8x0.25 smd: 1(-1.2,-1.498) 2(-1.2,-0.998) 3(-1.2,-0.498) 4(-1.2,0.002) 5(-1.2,0.502) 6(-1.2,1.002) 7(-1.2,1.502) 9(1.2,1.502) 10(1.2,1.002) 11(1.2,0.502) 12(1.2,0.002) 13(1.2,-0.498) 14(1.2,-0.998) 15(1.2,-1.498)
  rect 0.25x0.8 smd: 8(0,1.915) 16(0,-1.915)
R0402
  rect 0.566x0.54 smd: 1(-0.433,0) 2(0.433,0)
R0603
  rect 0.806x0.864 smd: 1(-0.753,0) 2(0.753,0)
SOD-882_L1.0-W0.6-RD
  rect 0.4x0.7 smd: 1(-0.35,0) 2(0.35,0)
SOT-23-3_L3.0-W1.7-P0.95-LS2.9-BR
  rect 1.038x0.532 smd: 1(1.102,-0.95) 2(1.102,0.95) 3(-1.101,0)
USB-C-SMD_TYPE-C-6PIN-2MD-073
  rect 0.55x1.1 smd: 1(-3.2,2.375) 2(-2.4,2.375) 11(2.4,2.375) 12(3.2,2.375)
  rect 0.3x1.1 smd: 3(-1.75,2.375) 4(-1.25,2.375) 5(-0.75,2.375) 6(-0.25,2.375) 7(0.25,2.375) 8(0.75,2.375) 9(1.25,2.375) 10(1.75,2.375)
  oval 1.1x2 hole 0.6x1.5: 13(-4.325,1.825) 14(4.325,1.825)
  oval 1.2x1.8 hole 0.6x1.2: 13(-4.325,-2.375) 14(4.325,-2.375)
VQFN-16_L3.0-W3.0-P0.50-TL-EP
  oval 0.8x0.28 smd: 1(-1.399,0.75) 2(-1.399,0.249) 3(-1.399,-0.249) 4(-1.399,-0.75) 9(1.399,-0.75) 10(1.399,-0.249) 11(1.399,0.249) 12(1.399,0.75)
  oval 0.28x0.8 smd: 5(-0.75,-1.399) 6(-0.249,-1.399) 7(0.249,-1.399) 8(0.75,-1.399) 13(0.75,1.399) 14(0.249,1.399) 15(-0.249,1.399) 16(-0.75,1.399)
  rect 1.6x1.6 smd: 17(0,0)
WIFIM-SMD_ESP32-C3-MINI-1
  rect 0.8x0.4 smd: 1(-5.9,4) 2(-5.9,3.2) 3(-5.9,2.4) 4(-5.9,1.6) 5(-5.9,0.8) 6(-5.9,0) 7(-5.9,-0.8) 8(-5.9,-1.6) 9(-5.9,-2.4) 10(-5.9,-3.2) 11(-5.9,-4) 25(5.9,-4) 26(5.9,-3.2) 27(5.9,-2.4) 28(5.9,-1.6) 29(5.9,-0.8) 30(5.9,0) 31(5.9,0.8) 32(5.9,1.6) 33(5.9,2.4) 34(5.9,3.2) 35(5.9,4)
  rect 0.4x0.8 smd: 12(-4.8,-4.9) 13(-4,-4.9) 14(-3.2,-4.9) 15(-2.4,-4.9) 16(-1.6,-4.9) 17(-0.8,-4.9) 18(0,-4.9) 19(0.8,-4.9) 20(1.6,-4.9) 21(2.4,-4.9) 22(3.2,-4.9) 23(4,-4.9) 24(4.8,-4.9) 36(4.8,4.9) 37(4,4.9) 38(3.2,4.9) 39(2.4,4.9) 40(1.6,4.9) 41(0.8,4.9) 42(0,4.9) 43(-0.8,4.9) 44(-1.6,4.9) 45(-2.4,4.9) 46(-3.2,4.9) 47(-4,4.9) 48(-4.8,4.9)
  custom 1.45x1.45 smd: 49(-1.975,1.975)
  rect 1.45x1.45 smd: 49(-1.975,0) 49(-1.975,-1.975) 49(0,1.975) 49(0,0) 49(0,-1.975) 49(1.975,1.975) 49(1.975,0) 49(1.975,-1.975)
  rect 0.7x0.7 smd: 50(5.95,4.95) 51(5.95,-4.95) 52(-5.95,-4.95) 53(-5.95,4.95)

## Nets
As in the schematic.

Pads without a net: U1 4 7 9 10 15 17 20 21 24 25 28 29 32 33 34 35; U2 1 2 5 12 13 16; U3 7 12 14 15; USB1 3 9

## Via types
v1: diameter 0.61, hole 0.305, Top Layer to Bottom Layer, 31 vias
v2: diameter 1.219, hole 0.61, Top Layer to Bottom Layer, 4 vias

## Routing (per net, layer and track width the routed paths; a pad name or vN(x,y) marks a point on that pad's centre or on a via; arc(x,y) is an arc through that point)
3V3: length 176.8
  Top Layer w0.254: 20.63,37.57 19.13,37.57 v1(18.44,36.88) 19.25,36.07 21.31,36.07 21.63,35.75 21.63,35.33 21.79,35.17 22.21,35.17 U2.7 ; 20.63,37.57 21.39,37.57 21.79,37.17 22.21,37.17 U2.3 ; 20.63,37.57 20.63,39.59 C3.2 20.05,41.35 20,41.4 ; v1(26.19,40.89) 26.21,40.89 26.83,41.52 ; U1.3 26.83,41.52 ; 26.83,41.52 26.44,41.91 R4.2 ; 48.22,26.74 49.02,26.74 C12.2 ; C11.2 47.33,26.75 47.35,26.74 ; v1(48.03,25.53) 48.73,26.23 48.73,26.23 ; 46.82,26.74 46.82,25.8 C10.2 ; R13.1 v1(34.95,24.9)
  Top Layer w0.508: 51.93,23.03 53.28,21.68 CN5.2 ; 51.93,23.03 50.82,24.15 ; 51.93,23.03 53.03,23.03 v2(53.62,23.62) ; 50.82,24.15 49.3,22.63 49.3,21.97 49.89,21.38 D6.1 ; 50.82,24.15 48.73,26.23 48.22,26.74 44.92,26.74 ; CN3.2 22.72,19.3 v2(22.88,19.3) ; D4.1 22.93,19.3 ; CN1.2 20.68,52.03 v2(19.46,50.8) 20.33,50.8 D1.1 ; D5.1 50.32,53.02 50.32,53.34 v2(51.21,54.23) 52.39,53.04 CN4.2
  Bottom Layer w0.254: v1(34.95,24.9) 40.85,24.9 42.96,22.78 45.22,22.78 47.34,24.9 47.4,24.9 v1(48.03,25.53) ; 17.72,40.88 17.73,40.89 v1(26.19,40.89)
  Bottom Layer w0.508: v2(51.21,54.23) 49.81,55.63 24.28,55.63 v2(19.46,50.8) 17.72,49.06 17.72,36.88 ; 17.72,36.88 17.72,31.96 18.44,31.24 19.58,31.24 27.2,23.62 ; 17.72,36.88 v1(18.44,36.88) ; v2(53.62,23.62) 47.51,23.62 45.15,21.26 43.3,21.26 40.94,23.62 27.2,23.62 ; 27.2,23.62 v2(22.88,19.3)
GND: length 346.3
  Top Layer w0.254: U1.52 29.38,35.07 U1.11 31.33,35.12 31.67,35.45 ; R16.1 47.64,48.46 47.64,48.38 47.8,48.21 48.6,48.21 49.15,48.76 50.67,48.76 Q3.2 ; R19.1 46.52,20.65 46.52,20.57 46.68,20.4 47.48,20.4 47.64,20.57 47.64,20.87 48.1,21.33 ; v1(21.11,36.83) 21.63,36.83 21.79,36.67 22.21,36.67 U2.4 22.4,36.48 22.82,36.48 22.99,36.31 22.99,35.83 22.82,35.67 22.4,35.67 U2.6 ; U1.49 U1.49 U1.49 ; v1(32.16,28.19) 32.88,27.47 32.88,27.27 32.9,27.24 U3.8 ; 19.91,38.07 18.82,38.07 ; 18.82,38.07 17.7,38.07 17.68,38.05 ; 18.82,38.07 18.82,38.08 v1(18.82,38.86) 18.96,39 18.96,40.17 18.91,40.22 C2.1 ; 52.4,17.03 CN5.3 ; U1.49 31.67,35.45 ; U1.49 U1.49 U1.49 ; 35.33,41.09 37.31,41.09 U1.49 U1.49 ; 35.33,41.09 33.36,41.09 ; 35.33,41.09 U1.42 ; 41.71,25.98 42.65,25.04 ; 41.71,25.98 D3.2 ; 41.71,25.98 41.15,25.98 40.98,25.82 39.96,25.82 39.41,26.37 39.38,26.37 ; R1.2 48.86,40.38 ; 48.86,40.38 45.18,44.07 U1.53 29.43,44.02 ; 48.86,40.38 USB1.12 ; C1.2 29.27,43.85 29.43,44.02 ; 29.43,44.02 U1.1 U1.2 ; 31.67,35.45 32.13,34.99 U1.14 ; 19.91,35.57 17.82,35.57 17.8,35.56 ; Q2.2 23.32,25.27 R18.1 ; C9.1 41.03,23.29 40.73,23.29 C7.1 39.05,24.71 C8.1 ; U1.49 37.31,36.73 39.14,34.89 40.46,34.89 41.19,34.17 41.28,34.17 ; v1(46.25,24.64) 45.71,25.18 C10.1 45.18,25.78 44.29,26.67 ; 51.95,25.16 v1(51.08,26.03) ; R12.1 23.01,46.3 23.01,46.22 23.17,46.06 23.97,46.06 25.1,47.18 25.1,49 25.61,49.51 25.61,50.44 ; C11.1 v1(44.73,28.07) ; 21.7,29.97 21.67,30 R6.1 ; R7.2 35.78,31.69 35.78,32.21 35.61,32.38 34.98,32.38 34.82,32.21 34.82,31.97 D2.2 34.6,30.8 C5.1 33.9,30.85 R9.1 31.95,31.56 30.64,31.56 30.06,30.99 v1(30,30.99) ; 17.42,21.21 17.31,21.21 ; R5.2 48.73,33.4 USB1.1
  Top Layer w0.381: v1(30,30.99) 28.99,30.99 R8.1 ; U3.5 U3.4 31.41,27.44 v1(32.16,28.19)
  Top Layer w0.508: 40.27,18.81 CN2.3 CN2.4 ; 40.27,18.81 38.35,20.73 ; 40.27,18.81 42,17.21 arc(42.92,17.13) 43.84,17.03 52.4,17.03 48.1,21.33 48.1,23.22 ; Q3.2 52.7,48.46 56.63,52.4 ; 17.31,52.25 17.31,43.56 arc(17.56,40.81) 17.68,38.05 arc(17.69,37.38) 17.69,36.7 arc(17.6,33.27) 17.31,29.84 ; 17.31,21.21 17.31,29.84 ; 17.31,29.84 17.44,29.97 R8.1 27.97,28.78 C4.1 ; 25.61,50.44 25.61,52.33 21.56,56.37 30.3,56.37 arc(33.66,56.1) 37.03,56 arc(40.4,56.1) 43.76,56.37 52.53,56.37 ; CN1.3 17.18,52.25 ; 44.29,26.67 38.35,20.73 ; 38.35,20.73 37.74,21.34 CN2.2 ; 56.63,52.4 CN4.4 ; 56.63,52.4 56.78,52.25 56.78,45.39 53.83,42.44 USB1.14 49.63,41.28 49.08,40.73 USB1.12 ; CN5.3 CN5.4 56.78,28.78 53.83,31.72 USB1.13 49.63,32.63 49.08,33.18 USB1.1 ; 17.42,21.21 22.12,25.91 22.54,25.91 Q2.2 ; 33.88,18.87 32.24,17.23 arc(31.36,17.16) 30.47,17.07 21.45,17.07 ; CN3.4 CN3.3
  Bottom Layer w0.254: v1(51.08,26.03) 48.35,26.03 48.27,26.11 47.79,26.11 47.71,26.03 47.65,26.03 v1(46.25,24.64) 44.73,26.16 v1(44.73,28.07) ; v1(18.82,38.86) 19.07,38.86 v1(21.11,36.83)
  Bottom Layer w0.508: v1(30,30.99) 32.16,28.83 v1(32.16,28.19)
VBAT: length 14.5
  Top Layer w0.381: 30.76,28.44 U3.3 30.74,27.93 30.3,27.93 30.01,27.64 ; 30.01,27.64 30.01,26.81 30,26.8 30,22.73 31.01,21.72 36.4,21.72 36.48,21.64 ; 30.01,27.64 30.01,27.83 C4.2
BAT: length 10.9
  Top Layer w0.254: v1(37.62,28.7) 37.36,28.45 R10.2 ; v1(38.38,31.88) 38.38,30.61 R7.1 35.33,33.65 U1.18
  Bottom Layer w0.254: v1(37.62,28.7) 38.38,29.46 v1(38.38,31.88)
CHG: length 11
  Top Layer w0.254: v1(33.93,26.41) 33.93,27.07 U3.9 ; U1.12 29.87,33.55 v1(29.87,32.64)
  Bottom Layer w0.254: v1(33.93,26.41) 33.93,27.88 30.24,31.57 30.24,32.27 v1(29.87,32.64)
DN: length 3.6
  Top Layer w0.254: U1.26 41.88,35.92 42.08,36.11 42.5,36.11 42.51,36.12 43.27,36.12 43.83,35.56 R2.2
DP: length 3.6
  Top Layer w0.254: R3.2 43.83,37.08 43.27,36.52 42.34,36.52 42.33,36.52 42.08,36.52 41.88,36.72 U1.27
I2C_SCL: length 22.7
  Top Layer w0.254: v1(40.23,32.06) 40.23,32.82 39.39,33.65 39.39,34.15 U1.23 ; v1(26.82,33.78) 25.94,34.66 U2.8
  Bottom Layer w0.254: v1(40.23,32.06) 40.17,32.12 38.96,32.12 37.3,33.78 v1(26.82,33.78)
I2C_SDA: length 25.7
  Top Layer w0.254: U1.22 38.53,33.63 v1(39.27,32.89) ; v1(24.79,33.78) 20.6,33.78 20.22,34.16 20.22,34.76 19.91,35.07
  Bottom Layer w0.254: v1(24.79,33.78) 25.04,33.78 29.15,37.89 33.89,37.89 38.9,32.88 39.26,32.88 v1(39.27,32.89)
MOTOR1: length 23.1
  Top Layer w0.254: R11.1 22.67,47.26 22.56,47.16 22.31,47.16 22.14,46.99 22.14,45.97 22.67,45.45 22.67,38.76 27.41,34.02 27.41,33.96 29.36,32 30.89,32 31.33,32.45 U1.13
MOTOR2: length 33.2
  Top Layer w0.254: R15.1 30.64,50.04 25.17,44.58 25.17,40.09 25.35,39.92 U1.5
MOTOR3: length 18
  Top Layer w0.254: R14.1 24.61,27.13 v1(25.17,27.69) ; U1.6 28.22,39.12 26.69,37.59 26.69,36.58 v1(27.96,35.31)
  Bottom Layer w0.254: v1(25.17,27.69) 27.96,30.48 27.96,31.81 26.24,33.54 26.24,34.02 27.52,35.31 v1(27.96,35.31)
MOTOR4: length 24.3
  Top Layer w0.254: 45.11,22.22 v1(44.86,21.97) ; v1(36.98,32.89) 36.13,33.74 U1.19 ; R17.1 45.11,22.22
  Bottom Layer w0.254: v1(44.86,21.97) 44.4,22.43 42.81,22.43 40.7,24.54 35.42,24.54 35.19,24.32 34.71,24.32 34.37,24.66 34.37,25.14 34.71,25.48 34.71,30.62 v1(36.98,32.89)
VUSB: length 27
  Top Layer w0.254: 35.38,29.54 35.37,29.55 C5.2 35.37,31.68 D2.1
  Top Layer w0.381: U3.13 32.96,29.54 38.62,29.54 43.64,34.56 USB1.2 49.24,34.71 49.78,34.71 50.33,35.27 50.33,38.64 49.78,39.2 49.24,39.2 USB1.11
$1N1713: length 34
  Top Layer w0.254: 42.38,27.31 42.41,27.28 D3.1 ; v1(38.51,28.07) 38.51,27.36 38.56,27.31 ; 37.37,27.31 37.4,27.28 37.4,26.11 ; 44.33,24.49 v1(43.2,23.37) ; C7.2 39.96,25.46 39.81,25.46 39.45,25.82 38.87,25.82 38.7,25.98 38.7,26.75 39,27.05 39,27.31 ; C6.2 40.52,26.41 40.52,27.31
  Top Layer w0.381: 44.78,27.3 44.77,27.31 35.08,27.31 ; 35.08,27.31 35.08,26.03 34.77,25.72 34.57,25.72 34.51,25.66 32.59,25.66 31.92,26.33 31.92,26.78 U3.6 ; 35.08,27.31 35.08,28.33 R10.1 34.95,28.44 33.55,28.44 U3.10
  Bottom Layer w0.254: v1(43.2,23.37) v1(38.51,28.07)
$1N1725: length 13.5
  Top Layer w0.254: U1.8 29.35,37.59 v1(27.58,37.59) ; v1(27.2,45.34) 27.2,44.69 R4.1 26.79,43.93 C1.1
  Bottom Layer w0.254: v1(27.2,45.34) 27.58,44.96 v1(27.58,37.59)
$1N1752: length 1.4
  Top Layer w0.254: R9.2 31.41,30.6 U3.16
$1N1757: length 1.7
  Top Layer w0.254: U3.1 29.73,29.97 R8.2
$1N2261: length 4.6
  Top Layer w0.508: D1.2 22.22,50.16 Q1.3 21.7,53 CN1.1
$1N2262: length 2.8
  Top Layer w0.254: Q1.1 24.26,48.57 R11.2 23.57,47.8 R12.2
$1N3276: length 4.5
  Top Layer w0.508: D5.2 50.03,52.1 50.7,51.43 51.11,51.43 Q3.3 53.28,52.11 CN4.1
$1N3282: length 2.8
  Top Layer w0.254: Q3.1 48.44,49.8 48.2,50.04 R16.2
$1N3530: length 5.5
  Top Layer w0.508: CN3.1 20.72,21.33 Q2.3 22.85,22.97 24.73,21.1
$1N3536: length 3.1
  Top Layer w0.254: Q2.1 25.48,24.74 25.48,26.54
$1N3784: length 4
  Top Layer w0.508: D6.2 51.2,21.5 51.2,21.6 ; 51.2,21.6 50.47,22.33 Q4.3 ; 51.2,21.6 CN5.1
$1N3790: length 5.3
  Top Layer w0.254: R19.2 47.11,20.98 R17.2 47.27,22.39 47.27,23.51 47.81,24.05 48.94,24.05 49.45,24.56
$1N3965: length 1.9
  Top Layer w0.254: R6.2 22.54,31.63 LED_B1.1
$1N3966: length 10.1
  Top Layer w0.254: v1(28.73,31.62) 26,31.62 25.99,31.64 ; v1(33.04,32.77) 33.73,33.45 U1.16
  Bottom Layer w0.254: v1(33.04,32.77) 30.57,32.77 30.11,33.22 29.63,33.22 29.29,32.88 29.29,32.18 v1(28.73,31.62)
$1N4623: length 6.8
  Top Layer w0.254: USB1.4 47.8,35.71 v1(47.52,35.43) ; v1(44.6,33.4) R5.1
  Bottom Layer w0.254: v1(44.6,33.4) 45.49,33.4 v1(47.52,35.43)
$1N4675: length 1.9
  Top Layer w0.254: R1.1 48.35,38.87 48.42,38.8 48.99,38.8 USB1.10
$1N4714: length 5.8
  Top Layer w0.254: R2.1 46.65,35.56 47.21,36.12 47.84,36.12 47.98,36.25 48.23,36.25 48.28,36.21 USB1.5 49.16,36.28 49.75,36.28 49.91,36.44 49.91,36.97 49.75,37.14 49.23,37.14 49.18,37.18 49.11,37.18 USB1.7
$1N4755: length 5.8
  Top Layer w0.254: USB1.8 49.01,37.64 48.42,37.64 48.26,37.47 48.26,36.94 48.42,36.78 49.01,36.78 USB1.6 48.28,36.71 48.23,36.66 47.81,36.66 47.68,36.52 47.21,36.52 46.65,37.08 R3.1
